# Altium project STM32屏幕调试模板.PrjPcb
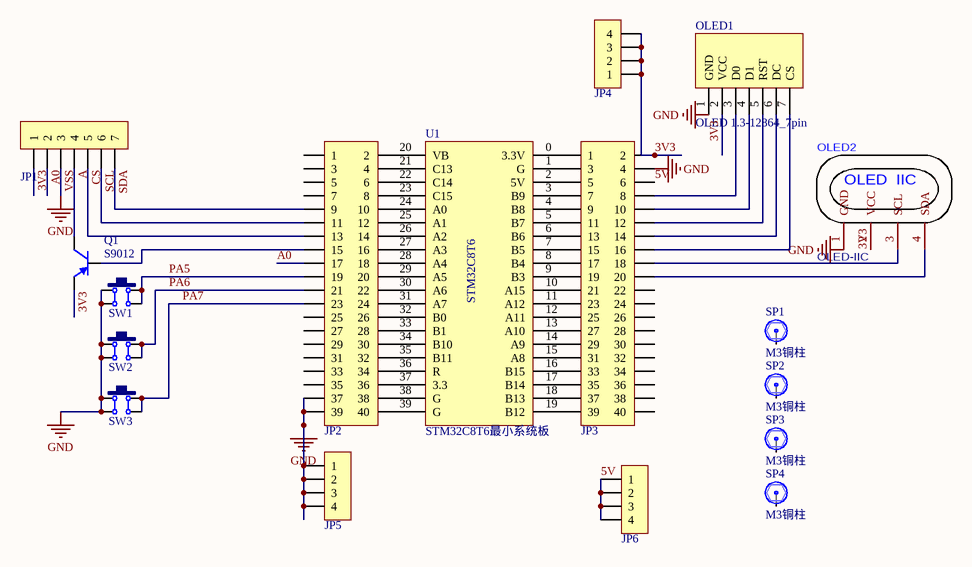
[diagram p0: Sheet1.SchDoc]
1 sheet, 17 parts. Net scope: global (net labels, ports and power ports of the same name join across sheets).
Board file: PCB2.PcbDoc

## Sheet Sheet1.SchDoc
size A4

### Parts
JP1  HDR-1X7  [XH2.54-WI-7P]  (value not drawn)
JP2  Header 2X11  [HDR2.54-LI-2x20P]  (value not drawn)
JP3  Header 2X11  [HDR2.54-LI-2x20P]  (value not drawn)
JP4  HDR-1X4  [HDR2.54-M-LI-4P]  (value not drawn)
JP5  HDR-1X4  [HDR2.54-LI-4P]  (value not drawn)
JP6  HDR-1X4  [HDR2.54-LI-4P]  (value not drawn)
OLED1  OLED 1.3-12864_7pin  [1.3-SPI-OLED]
OLED2  OLED-IIC  [0.96-IIC-OLED]
Q1  S9012  [TO92A]
SP1  M3铜柱  [M3x4_L]
SP2  M3铜柱  [M3x4_L]
SP3  M3铜柱  [M3x4_L]
SP4  M3铜柱  [M3x4_L]
SW1  12x12x5  [TSW DIP-12*12*4.3]  (value not drawn)
SW2  12x12x5  [TSW DIP-12*12*4.3]  (value not drawn)
SW3  12x12x5  [TSW DIP-12*12*4.3]  (value not drawn)
U1  STM32C8T6最小系统板  [STM32C8T6]

### Nets
VSS: JP1.3 JP2.37 JP2.39 JP3.4 JP5.1 JP5.2 JP5.3 JP5.4 OLED1.1(GND) OLED2.1(GND) SW1.1 SW1.4 SW2.1 SW2.4 SW3.1 SW3.4  [also labelled GND]
3V3: JP1.1 JP3.2 JP4.1 JP4.2 JP4.3 JP4.4 OLED1.2(VCC) OLED2.2(VCC) Q1.1(E)
5V: JP3.6 JP6.1 JP6.2 JP6.3 JP6.4
A: JP1.4 Q1.3(C)
A0: JP1.2 JP2.17
CS: JP1.5 JP2.13
PA5: JP2.19 SW1.2 SW1.3
PA6: JP2.21 SW2.2 SW2.3
PA7: JP2.23 SW3.2 SW3.3
SCL: JP1.6 JP2.11
SDA: JP1.7 JP2.9
NetJP2_2: JP2.2 U1.20(VB)
NetJP2_4: JP2.4 U1.21(C13)
NetJP2_6: JP2.6 U1.22(C14)
NetJP2_8: JP2.8 U1.23(C15)
NetJP2_10: JP2.10 U1.24(A0)
NetJP2_12: JP2.12 U1.25(A1)
NetJP2_14: JP2.14 U1.26(A2)
NetJP2_15: JP2.15 Q1.2(B)
NetJP2_16: JP2.16 U1.27(A3)
NetJP2_18: JP2.18 U1.28(A4)
NetJP2_20: JP2.20 U1.29(A5)
NetJP2_22: JP2.22 U1.30(A6)
NetJP2_24: JP2.24 U1.31(A7)
NetJP2_26: JP2.26 U1.32(B0)
NetJP2_28: JP2.28 U1.33(B1)
NetJP2_30: JP2.30 U1.34(B10)
NetJP2_32: JP2.32 U1.35(B11)
NetJP2_34: JP2.34 U1.36(R)
NetJP2_36: JP2.36 U1.37(3.3)
NetJP2_38: JP2.38 U1.38(G)
NetJP2_40: JP2.40 U1.39(G)
NetJP3_1: JP3.1 U1.0(3.3V)
NetJP3_3: JP3.3 U1.1(G)
NetJP3_5: JP3.5 U1.2(5V)
NetJP3_7: JP3.7 U1.3(B9)
NetJP3_8: JP3.8 OLED1.3(D0)
NetJP3_9: JP3.9 U1.4(B8)
NetJP3_10: JP3.10 OLED1.4(D1)
NetJP3_11: JP3.11 U1.5(B7)
NetJP3_12: JP3.12 OLED1.5(RST)
NetJP3_13: JP3.13 U1.6(B6)
NetJP3_14: JP3.14 OLED1.6(DC)
NetJP3_15: JP3.15 U1.7(B5)
NetJP3_16: JP3.16 OLED1.7(CS)
NetJP3_17: JP3.17 U1.8(B4)
NetJP3_18: JP3.18 OLED2.3(SCL)
NetJP3_19: JP3.19 U1.9(B3)
NetJP3_20: JP3.20 OLED2.4(SDA)
NetJP3_21: JP3.21 U1.10(A15)
NetJP3_23: JP3.23 U1.11(A12)
NetJP3_25: JP3.25 U1.12(A11)
NetJP3_27: JP3.27 U1.13(A10)
NetJP3_29: JP3.29 U1.14(A9)
NetJP3_31: JP3.31 U1.15(A8)
NetJP3_33: JP3.33 U1.16(B15)
NetJP3_35: JP3.35 U1.17(B14)
NetJP3_37: JP3.37 U1.18(B13)
NetJP3_39: JP3.39 U1.19(B12)

Not connected (* = marked no-connect by the designer): JP2 1 3 5 7 25 27 29 31 33 35; JP3 22 24 26 28 30 32 34 36 38 40; SP1 1; SP2 1; SP3 1; SP4 1

### Notes on the sheet
- (in symbol OLED-IIC) OLED  IIC
- (in symbol STM32C8T6最小系统板) STM32C8T6

### Library data of the parts
JP1 = Header 7  2.54: 7P接插件  2.54; 版权归属: 源创客; BOM名称: 7P接插件; 学习资源: www.ooocke.com
JP2 JP3 = Header 20X2  2.54: 20*2P接插件  2.54; 版权归属: 源创客; BOM名称: 20*2P接插件; 学习资源: www.ooocke.com
JP4-JP6 = Header 4  2.54: 4P接插件  2.54; 版权归属: 源创客; BOM名称: 4P接插件; 学习资源: www.ooocke.com
OLED1 = OLED-SPI: 12864 点阵屏; 版权归属: 源创客; BOM名称: 12864 点阵屏; 学习资源: www.ooocke.com
OLED2 = OLED-IIC: OLED 0.96寸 1.3寸 IIC显示屏
Q1 = 9012-DIP: 低频放大-PNP型; 版权归属: 源创客; 属性: 50V 0.5A 0.625W; BOM名称: 低频放大-PNP型; 学习资源: www.ooocke.com
SP1-SP4 = 铜柱小焊盘: 铜柱; 版权归属: 源创客; BOM名称: 铜柱; 学习资源: www.ooocke.com
SW1-SW3 = TSW DIP-12x12: 直插12x12轻触开关; 版权归属: 源创客; BOM名称: 直插12x12轻触开关; 学习资源: www.ooocke.com